# Altium schematic sheet AUDIO_IN&OUT.SchDoc
size A3
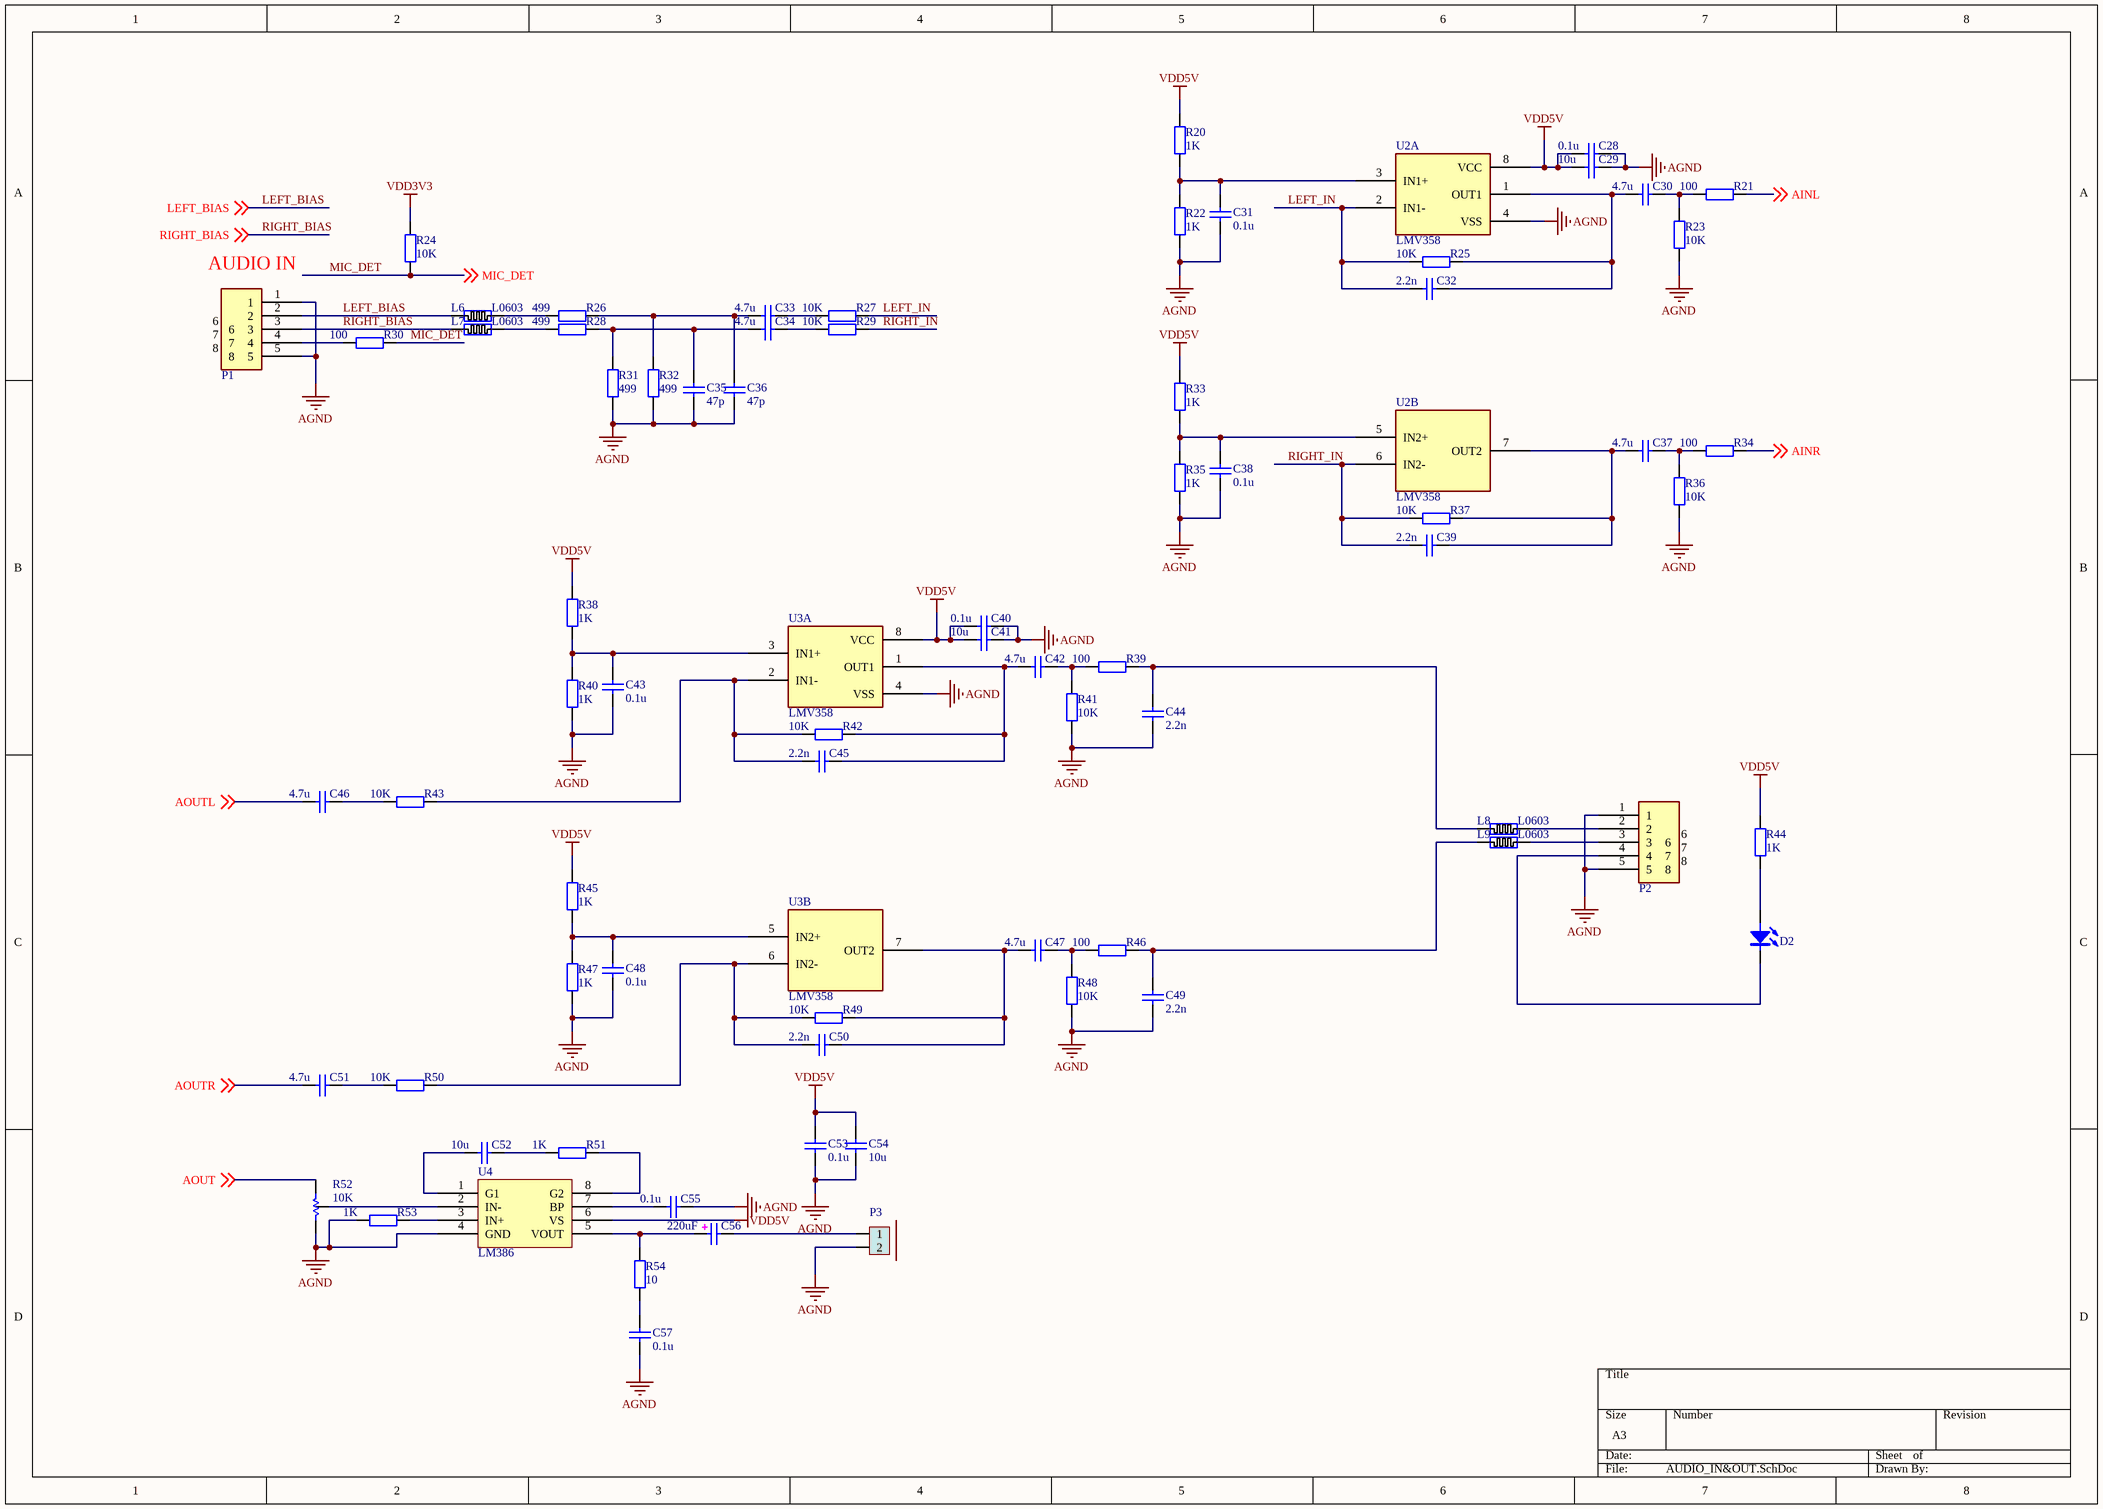
[diagram p0: AUDIO_IN&OUT.SchDoc]

## Parts
C28  0.1u  [C0603]
C29  10u  [C0603]
C30  4.7u  [C0603]
C31  0.1u  [C0603]
C32  2.2n  [C0603]
C33  4.7u  [C0603]
C34  4.7u  [C0603]
C35  47p  [C0603]
C36  47p  [C0603]
C37  4.7u  [C0603]
C38  0.1u  [C0603]
C39  2.2n  [C0603]
C40  0.1u  [C0603]
C41  10u  [C0603]
C42  4.7u  [C0603]
C43  0.1u  [C0603]
C44  2.2n  [C0603]
C45  2.2n  [C0603]
C46  4.7u  [C0603]
C47  4.7u  [C0603]
C48  0.1u  [C0603]
C49  2.2n  [C0603]
C50  2.2n  [C0603]
C51  4.7u  [C0603]
C52  10u  [C0603]
C53  0.1u  [C0603]
C54  10u  [C0603]
C55  0.1u  [C0603]
C56  220uF  [tc]
C57  0.1u  [C0603]
D2  LED_SMT  [LED0805]  (value not drawn)
L6  L0603  [L0603]
L7  L0603  [L0603]
L8  L0603  [L0603]
L9  L0603  [L0603]
P1  PHONE JACK  [AUDIO-8P]  (value not drawn)
P2  PHONE JACK  [AUDIO-8P]  (value not drawn)
P3  PIN  [SIP2]  (value not drawn)
R20  1K  [R0603]
R21  100  [R0603]
R22  1K  [R0603]
R23  10K  [R0603]
R24  10K  [R0603]
R25  10K  [R0603]
R26  499  [R0603]
R27  10K  [R0603]
R28  499  [R0603]
R29  10K  [R0603]
R30  100  [R0603]
R31  499  [R0603]
R32  499  [R0603]
R33  1K  [R0603]
R34  100  [R0603]
R35  1K  [R0603]
R36  10K  [R0603]
R37  10K  [R0603]
R38  1K  [R0603]
R39  100  [R0603]
R40  1K  [R0603]
R41  10K  [R0603]
R42  10K  [R0603]
R43  10K  [R0603]
R44  1K  [R0603]
R45  1K  [R0603]
R46  100  [R0603]
R47  1K  [R0603]
R48  10K  [R0603]
R49  10K  [R0603]
R50  10K  [R0603]
R51  1K  [R0603]
R52  10K  [RSET-SMT]
R53  1K  [R0603]
R54  10  [R0603]
U2  LMV358  [SO8/D/R-PDSO-G8]  (parts A,B of 2)
U3  LMV358  [SO8/D/R-PDSO-G8]  (parts A,B of 2)
U4  LM386  [SO8/D/R-PDSO-G8]

## Nets
AGND: C28.2 C29.2 C31.2 C35.2 C36.2 C38.2 C40.2 C41.2 C43.2 C44.1 C48.2 C49.1 C53.1 C54.1 C55.2 C57.2 P1.1 P1.5 P2.1 P2.5 P3.2 R22.1 R23.1 R31.1 R32.1 R35.1 R36.1 R40.1 R41.1 R47.1 R48.1 R52.1 R53.1 U2.4(VSS) U3.4(VSS) U4.4(GND)
VDD3V3: R24.2
VDD5V: C28.1 C29.1 C40.1 C41.1 C53.2 C54.2 R20.2 R33.2 R38.2 R44.2 R45.2 U2.8(VCC) U3.8(VCC) U4.6(VS)
AINL: R21.2 ; off-sheet AINL
AINR: R34.2 ; off-sheet AINR
AOUT: R52.3 ; off-sheet AOUT
AOUTL: C46.1 ; off-sheet AOUTL
AOUTR: C51.1 ; off-sheet AOUTR
LEFT_BIAS: L6.1 P1.2 ; off-sheet LEFT_BIAS
LEFT_IN: C32.1 R25.1 R27.2 U2.2(IN1-)
MIC_DET: R24.1 R30.2 ; off-sheet MIC_DET
RIGHT_BIAS: L7.1 P1.3 ; off-sheet RIGHT_BIAS
RIGHT_IN: C39.1 R29.2 R37.1 U2.6(IN2-)
NetC30_1: C30.1 C32.2 R25.2 U2.1(OUT1)
NetC30_2: C30.2 R21.1 R23.2
NetC31_1: C31.1 R20.1 R22.2 U2.3(IN1+)
NetC33_1: C33.1 C36.1 R26.2 R32.2
NetC33_2: C33.2 R27.1
NetC34_1: C34.1 C35.1 R28.2 R31.2
NetC34_2: C34.2 R29.1
NetC37_1: C37.1 C39.2 R37.2 U2.7(OUT2)
NetC37_2: C37.2 R34.1 R36.2
NetC38_1: C38.1 R33.1 R35.2 U2.5(IN2+)
NetC42_1: C42.1 C45.2 R42.2 U3.1(OUT1)
NetC42_2: C42.2 R39.1 R41.2
NetC43_1: C43.1 R38.1 R40.2 U3.3(IN1+)
NetC44_2: C44.2 L8.1 R39.2
NetC45_1: C45.1 R42.1 R43.2 U3.2(IN1-)
NetC46_2: C46.2 R43.1
NetC47_1: C47.1 C50.2 R49.2 U3.7(OUT2)
NetC47_2: C47.2 R46.1 R48.2
NetC48_1: C48.1 R45.1 R47.2 U3.5(IN2+)
NetC49_2: C49.2 L9.1 R46.2
NetC50_1: C50.1 R49.1 R50.2 U3.6(IN2-)
NetC51_2: C51.2 R50.1
NetC52_1: C52.1 U4.1(G1)
NetC52_2: C52.2 R51.1
NetC55_1: C55.1 U4.7(BP)
NetC56_1: C56.1 R54.2 U4.5(VOUT)
NetC56_2: C56.2 P3.1
NetC57_1: C57.1 R54.1
NetD2_A: D2.A R44.1
NetD2_K: D2.K P2.4
NetL6_2: L6.2 R26.1
NetL7_2: L7.2 R28.1
NetL8_2: L8.2 P2.2
NetL9_2: L9.2 P2.3
NetP1_4: P1.4 R30.1
NetR51_2: R51.2 U4.8(G2)
NetR52_2: R52.2 U4.2(IN-)
NetR53_2: R53.2 U4.3(IN+)

Not connected (* = marked no-connect by the designer): P1 6 7 8; P2 6 7 8

## Notes on the sheet
- (near P1) AUDIO IN

## Library data of the parts
C28-C55 C57 = CAP0603: 0603 Capacitor without Polarity
C56 = DCAP: 钽电容1210封装
D2 = LED_SMT: 贴片发光二极管
L6-L9 = L0603: 0603 Inductor
P1 P2 = PHONE JACK: 3.5mm AUDIO INPUT CONNECTOR with MIC
P3 = SIP2: Connectors with two pins
R20-R51 R53 R54 = RES0603: 0603 Resistor
R52 = Res1: 直插式可调电阻
U2 U3 = LMV358: AMP